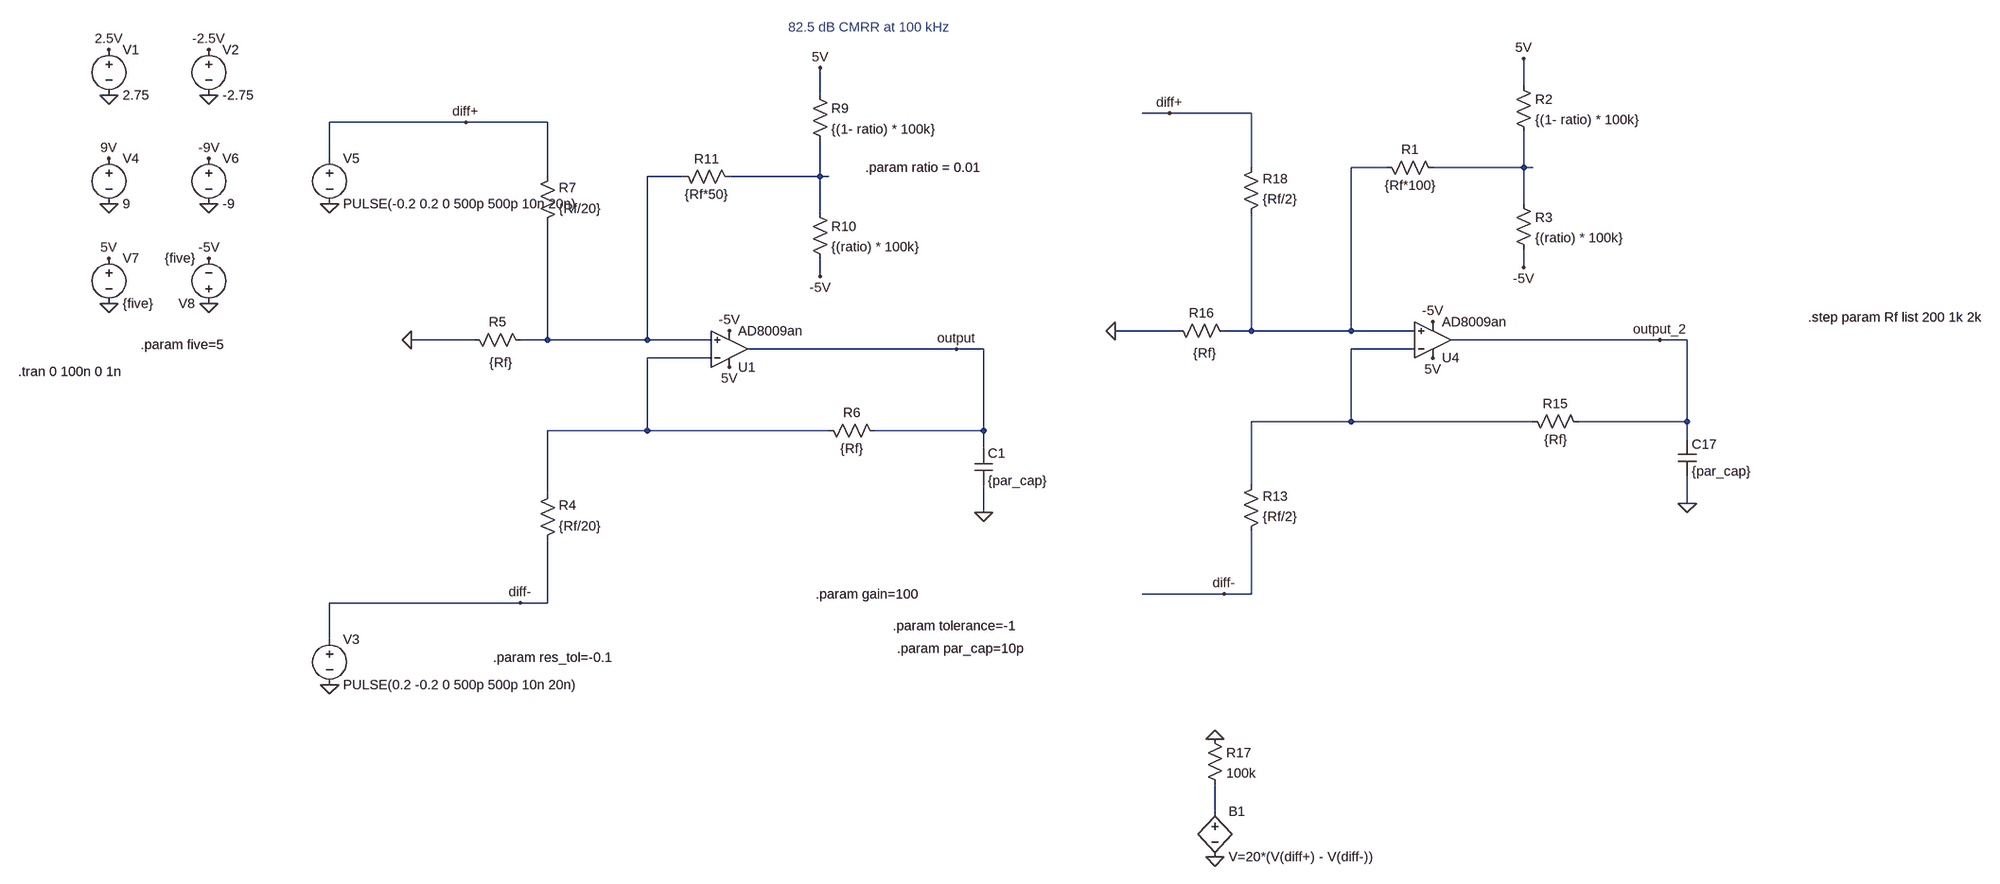
[diagram p0: schematic 400_output_offset.asc]
400_output_offset.asc, the LTspice schematic file:
Version 4
SHEET 1 4132 1588
WIRE 2864 -192 2864 -240
WIRE 1376 -176 1376 -224
WIRE 2240 -144 2192 -144
WIRE 2384 -144 2240 -144
WIRE 752 -128 512 -128
WIRE 896 -128 752 -128
WIRE 512 -64 512 -128
WIRE 2384 -48 2384 -144
WIRE 2624 -48 2560 -48
WIRE 2864 -48 2864 -112
WIRE 2864 -48 2704 -48
WIRE 2880 -48 2864 -48
WIRE 896 -32 896 -128
WIRE 1136 -32 1072 -32
WIRE 1376 -32 1376 -96
WIRE 1376 -32 1216 -32
WIRE 1392 -32 1376 -32
WIRE 2864 16 2864 -48
WIRE 1376 32 1376 -32
WIRE 2864 128 2864 96
WIRE 1376 144 1376 112
WIRE 2256 240 2144 240
WIRE 2384 240 2384 32
WIRE 2384 240 2336 240
WIRE 2560 240 2560 -48
WIRE 2560 240 2384 240
WIRE 2672 240 2560 240
WIRE 768 256 656 256
WIRE 896 256 896 48
WIRE 896 256 848 256
WIRE 1072 256 1072 -32
WIRE 1072 256 896 256
WIRE 1184 256 1072 256
WIRE 3104 256 2736 256
WIRE 3152 256 3104 256
WIRE 1616 272 1248 272
WIRE 1664 272 1616 272
WIRE 2672 272 2560 272
WIRE 1184 288 1072 288
WIRE 2560 400 2560 272
WIRE 2560 400 2384 400
WIRE 2880 400 2560 400
WIRE 3152 400 3152 256
WIRE 3152 400 2960 400
WIRE 1072 416 1072 288
WIRE 1072 416 896 416
WIRE 1392 416 1072 416
WIRE 1664 416 1664 272
WIRE 1664 416 1472 416
WIRE 3152 432 3152 400
WIRE 1664 448 1664 416
WIRE 2384 512 2384 400
WIRE 896 528 896 416
WIRE 3152 544 3152 496
WIRE 1664 560 1664 512
WIRE 2336 704 2192 704
WIRE 2384 704 2384 592
WIRE 2384 704 2336 704
WIRE 848 720 512 720
WIRE 896 720 896 608
WIRE 896 720 848 720
WIRE 512 784 512 720
WIRE 2320 1088 2320 1040
FLAG -80 -176 0
FLAG -80 -256 2.5V
FLAG 96 -176 0
FLAG 96 -256 -2.5V
FLAG -80 16 0
FLAG -80 -64 9V
FLAG 96 16 0
FLAG 96 -64 -9V
FLAG 2144 240 0
FLAG -80 192 0
FLAG -80 112 5V
FLAG 96 192 0
FLAG 2704 288 5V
FLAG 2704 224 -5V
FLAG 96 112 -5V
FLAG 2240 -144 diff+
FLAG 2336 704 diff-
FLAG 2320 1168 0
FLAG 2320 960 0
FLAG 3152 544 0
FLAG 2864 -240 5V
FLAG 2864 128 -5V
FLAG 3104 256 output_2
FLAG 656 256 0
FLAG 1216 304 5V
FLAG 1216 240 -5V
FLAG 752 -128 diff+
FLAG 848 720 diff-
FLAG 1664 560 0
FLAG 1376 -224 5V
FLAG 1376 144 -5V
FLAG 1616 272 output
FLAG 512 16 0
FLAG 512 864 0
SYMBOL voltage -80 -272 R0
SYMATTR InstName V1
SYMATTR Value 2.75
SYMBOL voltage 96 -272 R0
SYMATTR InstName V2
SYMATTR Value -2.75
SYMBOL res 2368 608 M180
WINDOW 0 36 76 Left 2
WINDOW 3 36 40 Left 2
SYMATTR InstName R13
SYMATTR Value {Rf/2}
SYMBOL res 2240 224 M90
WINDOW 0 0 56 VBottom 2
WINDOW 3 40 62 VTop 2
SYMATTR InstName R16
SYMATTR Value {Rf}
SYMBOL voltage -80 -80 R0
SYMATTR InstName V4
SYMATTR Value 9
SYMBOL voltage 96 -80 R0
SYMATTR InstName V6
SYMATTR Value -9
SYMBOL voltage -80 96 R0
SYMATTR InstName V7
SYMATTR Value {five}
SYMBOL voltage 96 208 R180
WINDOW 123 0 0 Left 0
WINDOW 39 0 0 Left 0
SYMATTR InstName V8
SYMATTR Value {five}
SYMBOL ZZZ\\OpAmp\\AD8009an 2704 256 M180
SYMATTR InstName U4
SYMBOL bv 2320 1072 R0
SYMATTR InstName B1
SYMATTR Value V=20*(V(diff+) - V(diff-))
SYMBOL res 2304 944 R0
SYMATTR InstName R17
SYMATTR Value 100k
SYMBOL res 2864 384 M90
WINDOW 0 0 56 VBottom 2
WINDOW 3 32 56 VTop 2
SYMATTR InstName R15
SYMATTR Value {Rf}
SYMBOL res 2368 48 M180
WINDOW 0 36 76 Left 2
WINDOW 3 36 40 Left 2
SYMATTR InstName R18
SYMATTR Value {Rf/2}
SYMBOL cap 3136 432 R0
SYMATTR InstName C17
SYMATTR Value {par_cap}
SYMBOL res 2720 -32 M270
WINDOW 0 32 56 VTop 2
WINDOW 3 0 56 VBottom 2
SYMATTR InstName R1
SYMATTR Value {Rf*100}
SYMBOL res 2848 -208 R0
SYMATTR InstName R2
SYMATTR Value {(1- ratio) * 100k}
SYMBOL res 2848 0 R0
SYMATTR InstName R3
SYMATTR Value {(ratio) * 100k}
SYMBOL voltage 512 -80 R0
WINDOW 123 0 0 Left 0
WINDOW 39 0 0 Left 0
SYMATTR InstName V5
SYMATTR Value PULSE(-0.2 0.2 0 500p 500p 10n 20n)
SYMBOL res 880 624 M180
WINDOW 0 36 76 Left 2
WINDOW 3 36 40 Left 2
SYMATTR InstName R4
SYMATTR Value {Rf/20}
SYMBOL res 752 240 M90
WINDOW 0 0 56 VBottom 2
WINDOW 3 40 62 VTop 2
SYMATTR InstName R5
SYMATTR Value {Rf}
SYMBOL ZZZ\\OpAmp\\AD8009an 1216 272 M180
SYMATTR InstName U1
SYMBOL res 1376 400 M90
WINDOW 0 0 56 VBottom 2
WINDOW 3 32 56 VTop 2
SYMATTR InstName R6
SYMATTR Value {Rf}
SYMBOL res 880 64 M180
WINDOW 0 36 76 Left 2
WINDOW 3 36 40 Left 2
SYMATTR InstName R7
SYMATTR Value {Rf/20}
SYMBOL cap 1648 448 R0
SYMATTR InstName C1
SYMATTR Value {par_cap}
SYMBOL res 1360 -192 R0
SYMATTR InstName R9
SYMATTR Value {(1- ratio) * 100k}
SYMBOL res 1360 16 R0
SYMATTR InstName R10
SYMATTR Value {(ratio) * 100k}
SYMBOL voltage 512 768 R0
WINDOW 123 0 0 Left 0
WINDOW 39 0 0 Left 0
SYMATTR InstName V3
SYMATTR Value PULSE(0.2 -0.2 0 500p 500p 10n 20n)
SYMBOL res 1232 -16 M270
WINDOW 0 32 56 VTop 2
WINDOW 3 0 56 VBottom 2
SYMATTR InstName R11
SYMATTR Value {Rf*50}
TEXT -240 312 Left 2 !.tran 0 100n 0 1n
TEXT -24 264 Left 2 !.param five=5
TEXT 1320 -296 Left 2 ;82.5 dB CMRR at 100 kHz
TEXT 3648 216 Left 2 !.step param Rf list 200 1k 2k
TEXT 1504 760 Left 2 !.param tolerance=-1
TEXT 1512 800 Left 2 !.param par_cap=10p
TEXT 800 816 Left 2 !.param res_tol=-0.1
TEXT 1368 704 Left 2 !.param gain=100
TEXT 1456 -48 Left 2 !.param ratio = 0.01

The netlist it stands for:
* 400_output_offset.asc
V1 2.5V 0 2.75
V2 -2.5V 0 -2.75
R13 diff- N005 {Rf/2}
R16 0 N001 {Rf}
V4 9V 0 9
V6 -9V 0 -9
V7 5V 0 {five}
V8 0 -5V {five}
* U4: AD8009an (symbol ZZZ\OpAmp\AD8009an not available, pins judged from their places): In+=N001 In-=N005 V+=5V V-=-5V OUT=output_2
B1 N007 0 V=20*(V(diff+) - V(diff-))
R17 0 N007 100k
R15 N005 output_2 {Rf}
R18 N001 diff+ {Rf/2}
C17 output_2 0 {par_cap}
R1 N002 N001 {Rf*100}
R2 5V N002 {(1- ratio) * 100k}
R3 N002 -5V {(ratio) * 100k}
V5 diff+ 0 PULSE(-0.2 0.2 0 500p 500p 10n 20n)
R4 diff- N006 {Rf/20}
R5 0 N003 {Rf}
* U1: AD8009an (symbol ZZZ\OpAmp\AD8009an not available, pins judged from their places): In+=N003 In-=N006 V+=5V V-=-5V OUT=output
R6 N006 output {Rf}
R7 N003 diff+ {Rf/20}
C1 output 0 {par_cap}
R9 5V N004 {(1- ratio) * 100k}
R10 N004 -5V {(ratio) * 100k}
V3 diff- 0 PULSE(0.2 -0.2 0 500p 500p 10n 20n)
R11 N004 N003 {Rf*50}
.tran 0 100n 0 1n
.param five=5
* 82.5 dB CMRR at 100 kHz
.step param Rf list 200 1k 2k
.param tolerance=-1
.param par_cap=10p
.param res_tol=-0.1
.param gain=100
.param ratio = 0.01
.backanno
.end